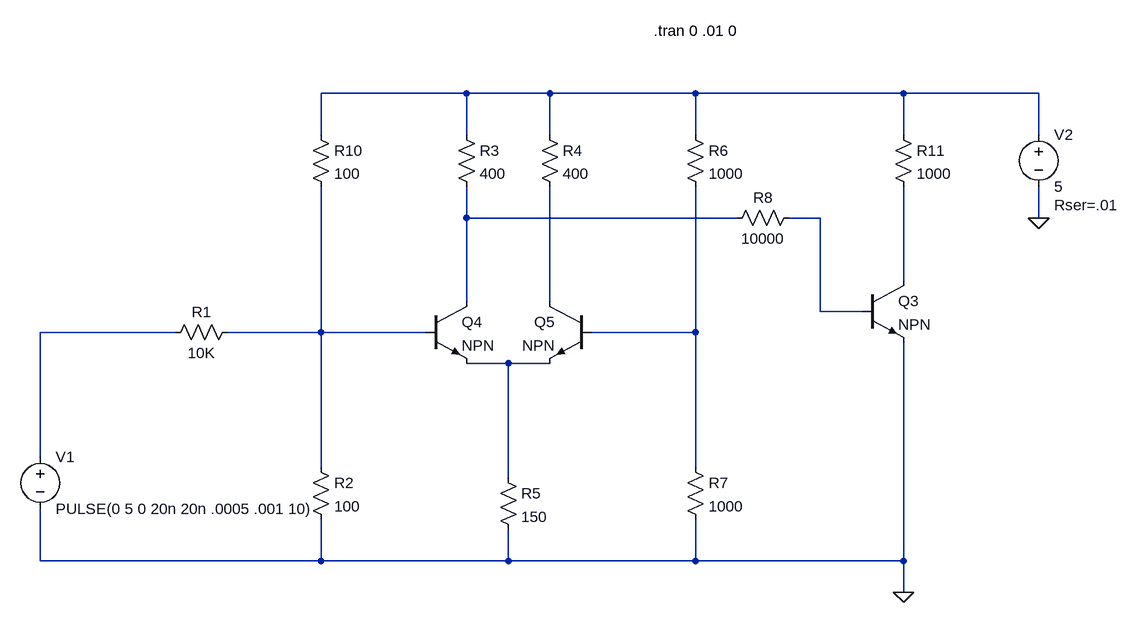
[diagram p0: schematic Draft1.asc]
Draft1.asc, the LTspice schematic file:
Version 4
SHEET 1 1392 820
WIRE 384 32 160 32
WIRE 512 32 384 32
WIRE 736 32 512 32
WIRE 1056 32 736 32
WIRE 1264 32 1056 32
WIRE 160 96 160 32
WIRE 384 96 384 32
WIRE 512 96 512 32
WIRE 736 96 736 32
WIRE 1056 96 1056 32
WIRE 1264 96 1264 32
WIRE 384 224 384 176
WIRE 800 224 384 224
WIRE 928 224 880 224
WIRE 1264 224 1264 176
WIRE 1056 320 1056 176
WIRE 384 352 384 224
WIRE 512 352 512 176
WIRE 928 368 928 224
WIRE 992 368 928 368
WIRE -64 400 -272 400
WIRE 160 400 160 176
WIRE 160 400 16 400
WIRE 320 400 160 400
WIRE 736 400 736 176
WIRE 736 400 576 400
WIRE 448 448 384 448
WIRE 512 448 448 448
WIRE -272 592 -272 400
WIRE 160 608 160 400
WIRE 736 608 736 400
WIRE 448 624 448 448
WIRE -272 752 -272 672
WIRE 160 752 160 688
WIRE 160 752 -272 752
WIRE 448 752 448 704
WIRE 448 752 160 752
WIRE 736 752 736 688
WIRE 736 752 448 752
WIRE 1056 752 1056 416
WIRE 1056 752 736 752
WIRE 1056 800 1056 752
FLAG 1056 800 0
FLAG 1264 224 0
SYMBOL res 144 592 R0
SYMATTR InstName R2
SYMATTR Value 100
SYMATTR SpiceLine tol=1 pwr=.25
SYMBOL res 368 80 R0
SYMATTR InstName R3
SYMATTR Value 400
SYMATTR SpiceLine tol=1 pwr=.25
SYMBOL res 496 80 R0
SYMATTR InstName R4
SYMATTR Value 400
SYMATTR SpiceLine tol=1 pwr=.25
SYMBOL res 432 608 R0
SYMATTR InstName R5
SYMATTR Value 150
SYMATTR SpiceLine tol=1 pwr=.25
SYMBOL res 720 80 R0
SYMATTR InstName R6
SYMATTR Value 1000
SYMATTR SpiceLine tol=1 pwr=.25
SYMBOL res 720 592 R0
SYMATTR InstName R7
SYMATTR Value 1000
SYMATTR SpiceLine tol=1 pwr=.25
SYMBOL res 32 384 R90
WINDOW 0 0 56 VBottom 2
WINDOW 3 32 56 VTop 2
SYMATTR InstName R1
SYMATTR Value 10K
SYMATTR SpiceLine tol=1 pwr=.25
SYMBOL npn 992 320 R0
SYMATTR InstName Q3
SYMBOL res 896 208 R90
WINDOW 0 0 56 VBottom 2
WINDOW 3 32 56 VTop 2
SYMATTR InstName R8
SYMATTR Value 10000
SYMATTR SpiceLine tol=1 pwr=.25
SYMBOL res 144 80 R0
SYMATTR InstName R10
SYMATTR Value 100
SYMATTR SpiceLine tol=1 pwr=.25
SYMBOL res 1040 80 R0
SYMATTR InstName R11
SYMATTR Value 1000
SYMATTR SpiceLine tol=1 pwr=.25
SYMBOL voltage -272 576 R0
WINDOW 123 0 0 Left 2
WINDOW 39 0 0 Left 2
SYMATTR InstName V1
SYMATTR Value PULSE(0 5 0 20n 20n .0005 .001 10)
SYMBOL voltage 1264 80 R0
WINDOW 123 0 0 Left 2
WINDOW 39 24 124 Left 2
SYMATTR InstName V2
SYMATTR Value 5
SYMATTR SpiceLine Rser=.01
SYMBOL npn 320 352 R0
SYMATTR InstName Q4
SYMBOL npn 576 352 M0
SYMATTR InstName Q5
TEXT 672 -64 Left 2 !.tran 0 .01 0

The netlist it stands for:
* Draft1.asc
R2 N007 0 100 tol=1 pwr=.25
R3 N001 N002 400 tol=1 pwr=.25
R4 N001 N005 400 tol=1 pwr=.25
R5 N009 0 150 tol=1 pwr=.25
R6 N001 N008 1000 tol=1 pwr=.25
R7 N008 0 1000 tol=1 pwr=.25
R1 N007 N006 10K tol=1 pwr=.25
Q3 N004 N003 0 0 NPN
R8 N003 N002 10000 tol=1 pwr=.25
R10 N001 N007 100 tol=1 pwr=.25
R11 N001 N004 1000 tol=1 pwr=.25
V1 N006 0 PULSE(0 5 0 20n 20n .0005 .001 10)
V2 N001 0 5 Rser=.01
Q4 N002 N007 N009 0 NPN
Q5 N005 N008 N009 0 NPN
.model NPN NPN
.model PNP PNP
.lib standard.bjt
.tran 0 .01 0
.backanno
.end